# Altium schematic sheet PAPAYA_PCB.SchDoc: P.A.P.A.Y.A
size A3 portrait; Author: IMBULPITIYA B.N.; DrawnBy: IMBULPITIYA B.N.; DocumentNumber: -; Revision: Rev 1.0; SheetNumber: 1; SheetTotal: 1
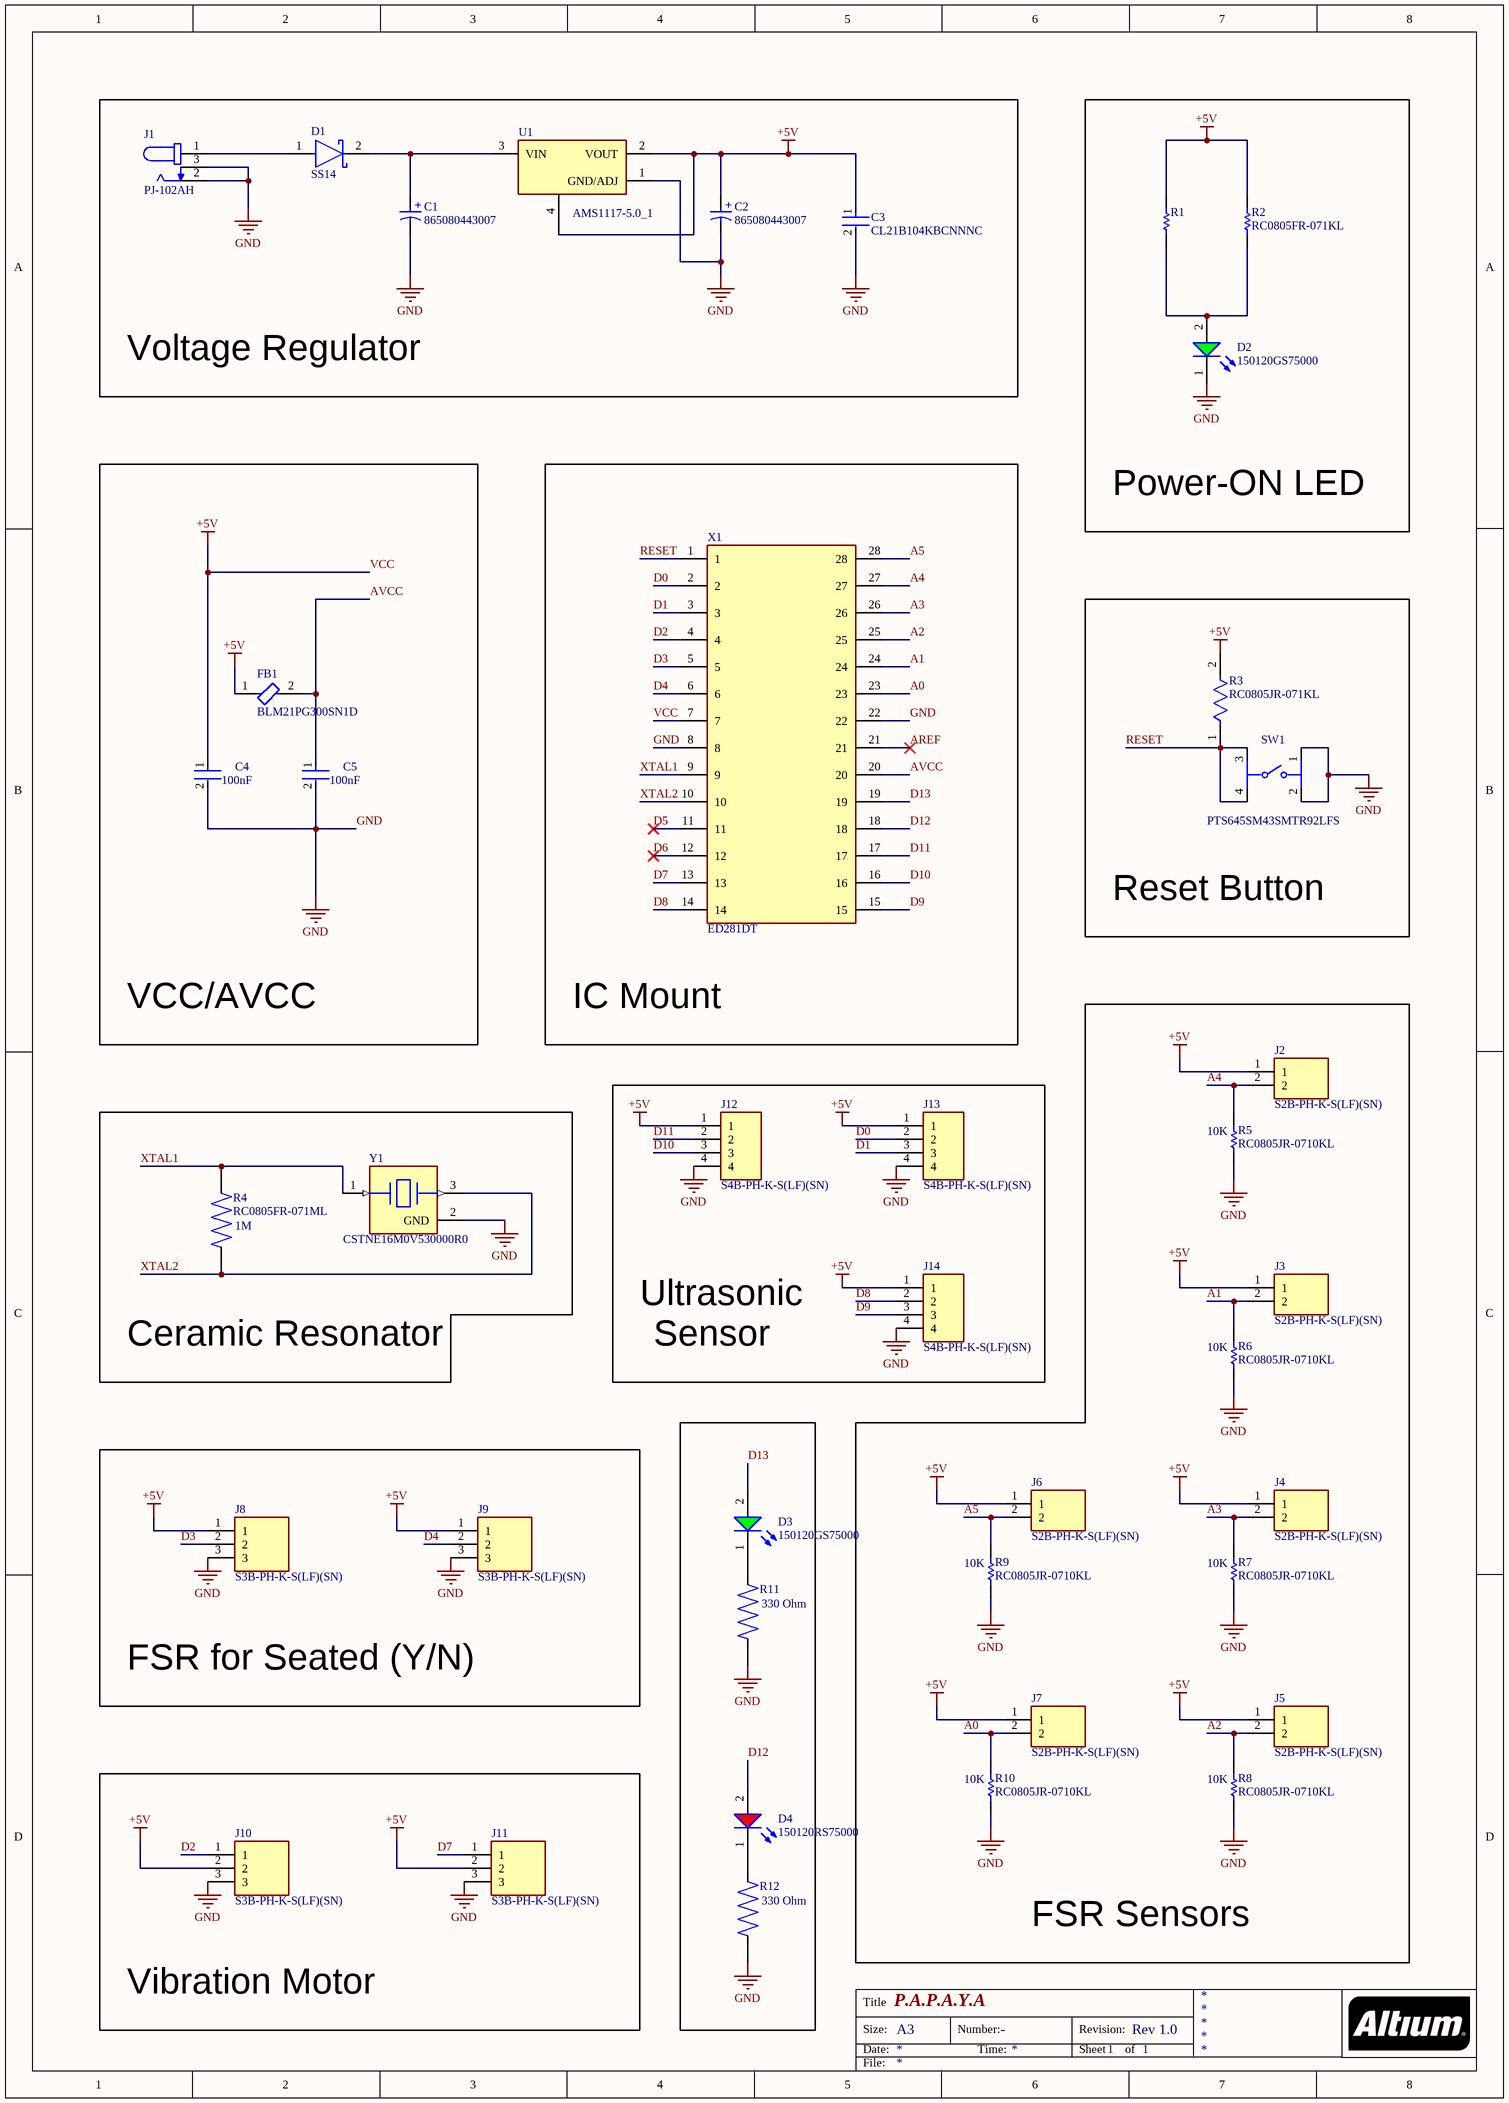
[diagram p0: PAPAYA_PCB.SchDoc]

## Parts
C1  865080443007  [WCAP-ASLI_D6.3H5.5]
C2  865080443007  [WCAP-ASLI_D6.3H5.5]
C3  CL21B104KBCNNNC  [FP-CL21-IPC_C]
C4  Capacitance: 100nF  [FP-CL21-IPC_C]  (hidden comment: CL21B104KBCNNNC)
C5  Capacitance: 100nF  [FP-CL21-IPC_C]  (hidden comment: CL21B104KBCNNNC)
D1  SS14  [FP-403AE-MFG]
D2  150120GS75000  [WL-SMCW_1206_150120xx75000]
D3  150120GS75000  [WL-SMCW_1206_150120xx75000]
D4  150120RS75000  [WL-SMCW_1206_150120xx75000]
FB1  BLM21PG300SN1D  [FP-BLM21-0_2-t0_85-e0_5-d-MFG]
J1  PJ-102AH  [CUI_PJ-102AH]
J2  S2B-PH-K-S(LF)(SN)  [JST_S2B-PH-K-S(LF)(SN)]
J3  S2B-PH-K-S(LF)(SN)  [JST_S2B-PH-K-S(LF)(SN)]
J4  S2B-PH-K-S(LF)(SN)  [JST_S2B-PH-K-S(LF)(SN)]
J5  S2B-PH-K-S(LF)(SN)  [JST_S2B-PH-K-S(LF)(SN)]
J6  S2B-PH-K-S(LF)(SN)  [JST_S2B-PH-K-S(LF)(SN)]
J7  S2B-PH-K-S(LF)(SN)  [JST_S2B-PH-K-S(LF)(SN)]
J8  S3B-PH-K-S(LF)(SN)  [JST_S3B-PH-K-S(LF)(SN)]
J9  S3B-PH-K-S(LF)(SN)  [JST_S3B-PH-K-S(LF)(SN)]
J10  S3B-PH-K-S(LF)(SN)  [JST_S3B-PH-K-S(LF)(SN)]
J11  S3B-PH-K-S(LF)(SN)  [JST_S3B-PH-K-S(LF)(SN)]
J12  S4B-PH-K-S(LF)(SN)  [JST_S4B-PH-K-S(LF)(SN)]
J13  S4B-PH-K-S(LF)(SN)  [JST_S4B-PH-K-S(LF)(SN)]
J14  S4B-PH-K-S(LF)(SN)  [JST_S4B-PH-K-S(LF)(SN)]
R1  RC0805FR-071KL  [RESC2013X60X35ML10T20]  (value not drawn)
R2  RC0805FR-071KL  [RESC2013X60X35ML10T20]
R3  RC0805JR-071KL  [FP-RC0805-0_6-MFG]
R4  RC0805FR-071ML  value 1M  [RESC2012X60N]
R5  RC0805JR-0710KL  Resistance: 10K  [RESC2013X60X35ML10T20]
R6  RC0805JR-0710KL  Resistance: 10K  [RESC2013X60X35ML10T20]
R7  RC0805JR-0710KL  Resistance: 10K  [RESC2013X60X35ML10T20]
R8  RC0805JR-0710KL  Resistance: 10K  [RESC2013X60X35ML10T20]
R9  RC0805JR-0710KL  Resistance: 10K  [RESC2013X60X35ML10T20]
R10  RC0805JR-0710KL  Resistance: 10K  [RESC2013X60X35ML10T20]
R11  value 330 Ohm  [RESC2012X60N]  (hidden comment: RC0805JR-07330RL)
R12  value 330 Ohm  [RESC2012X60N]  (hidden comment: RC0805JR-07330RL)
SW1  PTS645SM43SMTR92LFS  [SWITCH_43SMTR92LFS]
U1  AMS1117-5.0_1  [SOT229P700X180-4N]
X1  ED281DT  [OST_ED281DT]
Y1  CSTNE16M0V530000R0  [FP-CSTNE16M0V530000R0-MFG]

## Blocks framed on the sheet
Voltage Regulator: C1-C3 D1 J1 U1
Power-ON LED: D2 R1 R2
VCC/AVCC: C4 C5 FB1
IC Mount: X1
Reset Button: R3 SW1
FSR Sensors: J2-J7 R5-R10
Ceramic Resonator: R4 Y1
FSR for Seated (Y/N): J8 J9
Vibration Motor: J10 J11

## Nets
GND: C1.2(N) C2.2(N) C3.2 C4.2 C5.2 D2.1(K) J1.2 J1.3 J8.3 J9.3 J10.3 J11.3 J12.4 J13.4 J14.4 R5.1 R6.1 R7.1 R8.1 R9.1 R10.1 R11.1 R12.1 SW1.1 SW1.2 U1.1(GND/ADJ) X1.8 X1.22 Y1.2(GND)
VCC: C2.1(P) C3.1 C4.1 FB1.1 J2.1 J3.1 J4.1 J5.1 J6.1 J7.1 J8.1 J9.1 J10.2 J11.2 J12.1 J13.1 J14.1 R1.2 R2.2 R3.2 U1.2(VOUT) U1.4(TAB) X1.7  [also labelled +5V]
A0: J7.2 R10.2 X1.23
A1: J3.2 R6.2 X1.24
A2: J5.2 R8.2 X1.25
A3: J4.2 R7.2 X1.26
A4: J2.2 R5.2 X1.27
A5: J6.2 R9.2 X1.28
AREF: X1.21
AVCC: C5.1 FB1.2 X1.20
D0: J13.2 X1.2
D1: J13.3 X1.3
D2: J10.1 X1.4
D3: J8.2 X1.5
D4: J9.2 X1.6
D5: X1.11
D6: X1.12
D7: J11.1 X1.13
D8: J14.2 X1.14
D9: J14.3 X1.15
D10: J12.3 X1.16
D11: J12.2 X1.17
D12: D4.2(A) X1.18
D13: D3.2(A) X1.19
RESET: R3.1 SW1.3 SW1.4 X1.1
XTAL1: R4.2 X1.9 Y1.1(Input)
XTAL2: R4.1 X1.10 Y1.3(Output)
NetC1_1: C1.1(P) D1.2(C) U1.3(VIN)
NetD1_1: D1.1(A) J1.1
NetD2_2: D2.2(A) R1.1 R2.1
NetD3_1: D3.1(K) R11.2
NetD4_1: D4.1(K) R12.2

## Notes on the sheet
- Ultrasonic
- Sensor
- Title
- Size:
- Date:
- A3
- Number:
- Time:
- Revision:
- Sheet
- of
- File:
- (in symbol CMP-03913-53914590-1) +

## Library data of the parts
C1 C2 = CMP-03913-53914590-1: 865080443007 WCAP-ASLI Aluminum Electrolytic Capacitors; Polarity: Polar; Insulation Resistance: 2.12766MΩ; Ripple Current: 220mA; Voltage Rating: 25V; Leakage Current: 11.75µA; Capacitance: 47µF; ESR (Equivalent Series Resistance): 397.678mΩ; Life (Hours): 2000hours; Tolerance: 20%; Impedance: 560mΩ; Max Operating Temperature: 105°C; Packaging: Cut Tape (CT); Height: 5.5mm; Width: 6.6mm; Min Operating Temperature: -55°C; Length: 5.5mm; Mount: Surface Mount; Height - Seated (Max): 5.5118mm; Voltage Rating (DC): 25V; Diameter: 6.3mm; REACH SVHC: Unknown; NexarPartId: 53914590; RoHS: Compliant; Case/Package: Radial; Ripple Current (AC): 220mA
C3-C5 = CMP-2000-05017-2: CL21 Series 0805 100nF 50V ±10% Tolerance X7R Multilayer Ceramic Chip Capacitor; Depth: 1.25mm; Height: 0.85mm; Width: 0.049inch; Tolerance: 10%; Case Code (Metric): 2012; Case Code (Imperial): 0805; Material: Ceramic; Thickness: 0.037inch; Min Operating Temperature: -55°C; Contact Plating: Tin; Length: 2mm; Mount: Surface Mount; Voltage Rating (DC): 50V; Lead Free: Lead Free; Dielectric: X7R; Radiation Hardening: No; Voltage Rating: 50V; Case/Package: 0805; Packaging: Tape and Reel; Max Operating Temperature: 125°C; Voltage: 50V
  C3: Capacitance: 100nF
D1 = CMP-2000-04943-2: DIODE SCHOTTKY 40V 1A SMA; Manufacturer: ON Semiconductor; Peak Reverse Current: 0.2mA; Max Junction Temp: +125°C; Standoff Height: 0.05mm; Max Surge Forward Current: 40A; Mouser Description: Schottky Diodes & Rectifiers SMA 40V 1.0A; RoHS: TRUE; Lead Free: Yes; Manufacturer Part Number: SS14; Device Class L3: Schottky Diodes; Category: Diode; Automotive: No; Digikey Description: DIODE SCHOTTKY 40V 1A SMA; ComponentLink2Description: Datasheet; Device Class L2: Diodes; Height: 2.5mm; Temperature Range High: +125°C; ComponentLink2URL: https://www.onsemi.com/pub/Collateral/SS19-D.PDF; Device Class L1: Discrete Semiconductors; Package: 403AE; Octopart: https://octopart.com/ss14-on+semiconductor-29205033; Max Repetitive Reverse Voltage: 40V; Temperature Range Low: -65°C; Forward Current: 1A; Temperature: -65°C to +125°C
D2 D3 = CMP-1426-00007-3: WURTH ELEKTRONIK - 150080GS75000 - LED, Green, SMD, 0805, 30 mA, 3.2 V, 520 nm; Forward Voltage: 3.2V; Viewing Angle: 140°; Power Dissipation: 105mW; Peak Wavelength: 515nm; Max Reverse Voltage (DC): 5V; Luminous Intensity: 450mcd; Wavelength: 525nm; Max Junction Temperature (Tj): 95°C; Forward Current: 100mA; Test Current: 20mA; Lens Style: Clear, Rectangular; Length: 2mm; Case/Package: 0805; Case Code (Metric): 2012; Color: Green; Height: 700µm; Width: 1.25mm; Packaging: Tape and Reel; Mount: Surface Mount; REACH SVHC: Unknown; RoHS: Compliant; Min Operating Temperature: -40°C; Reverse Voltage: 5V; Max Operating Temperature: 85°C; Dominant Wavelength: 525nm; Case Code (Imperial): 0805
D4 = CMP-1426-00011-3: LED Uni-Color Red 630nm 2-Pin Chip 0805(2012Metric) T/R; Viewing Angle: 140°; Max Junction Temperature (Tj): 95°C; Power Dissipation: 72mW; Forward Current: 100mA; Forward Voltage: 2V; Wavelength: 625nm; Test Current: 20mA; Max Reverse Voltage (DC): 5V; Luminous Intensity: 150mcd; Lens Style: Clear, Rectangular; REACH SVHC: Unknown; Height: 700µm; Case Code (Metric): 2012; Peak Wavelength: 630nm; Length: 2mm; Width: 1.25mm; RoHS: Compliant; Packaging: Tape and Reel; Dominant Wavelength: 625nm; Color: Red; Case Code (Imperial): 0805; Min Operating Temperature: -40°C; Mount: Surface Mount; Max Operating Temperature: 85°C; Case/Package: 0805
FB1 = CMP-0686-00620-3: Chip Ferrite Bead, 0805, 30Ω @ 100MHz, 0.014Ω, , 4A; Tolerance: 25%; Number of Circuits: 1; Impedance: 30R; Max DC Current: 3A; Shielding: Unshielded; Material: Steel; Resistance: 15mR; DC Resistance-Max: 14mR; Series: BLM21P; Military Standard: Not; Max Current Rating: 4A; Termination: SMD/SMT; Length: 2mm; Width: 1.25mm; Test Frequency: 100MHz; Packaging: Tape and Reel; Case/Package: 0805; Current Rating: 4A; Depth: 1.25mm; Package Quantity: 1; REACH SVHC: No SVHC; Core Material: Ferrite; Max Operating Temperature: 125°C; DC Current: 3A; Height: 0.85mm; Frequency: 100MHz; Number of Lines: 1; Case Code (Metric): 2012; Min Operating Temperature: -55°C; Radiation Hardening: No; Case Code (Imperial): 0805; Number of Pins: 2; RoHS Compliant: Yes; DC Resistance (DCR): 14mR; Lead Free: Lead Free
J1 = PJ-102AH: 2.0 x 6.5 mm, 5.0 A, Horizontal, Through Hole, Tapered Pins, Dc Power Jack Connector; MF: Same Sky; SnapEDA_Link: https://www.snapeda.com/parts/PJ-102AH/Same+Sky/view-part/?ref=snap; Package: None; Value: *; MP: PJ-102AH; Check_prices: https://www.snapeda.com/parts/PJ-102AH/Same+Sky/view-part/?ref=eda; Supplier: Digikey; Supplier Part Number: CP-102AH-ND; Manufacturer: Same Sky; Manufacturer Part Number: PJ-102AH; RoHS: No; Stock: 37690; Pricing: 1=0.76, 10=0.646, 25=0.6056, 50=0.5766, 200=0.5227, 400=0.4977, 600=0.48367, 1000=0.46653, 2600=0.43611 (USD); ComponentLink1URL: https://datasheet.octopart.com/PJ-102AH-Same-Sky-datasheet-182049965.pdf?src-supplier=Future+Electronics; ComponentLink1Description: https://datasheet.octopart.com/PJ-102AH-Same-Sky-datasheet-182049965.pdf?src-supplier=Future+Electronics; ComponentLink2URL: http://www.cui.com/Product/Resource/FuturePDF/PJ-102AH.pdf?src-supplier=Future+Electronics; ComponentLink2Description: http://www.cui.com/Product/Resource/FuturePDF/PJ-102AH.pdf?src-supplier=Future+Electronics; ComponentLink3URL: https://datasheet.octopart.com/PJ-102AH-Same-Sky-datasheet-182881008.pdf?src-supplier=Electro+Sonic; ComponentLink3Description: https://datasheet.octopart.com/PJ-102AH-Same-Sky-datasheet-182881008.pdf?src-supplier=Electro+Sonic; ComponentLink4URL: https://datasheet.octopart.com/PJ-102AH-CUI-Devices-datasheet-175925642.pdf?src-supplier=Master+Electronics; ComponentLink4Description: https://datasheet.octopart.com/PJ-102AH-CUI-Devices-datasheet-175925642.pdf?src-supplier=Master+Electronics
J2-J7 = S2B-PH-K-S(LF)(SN): Connector Header Through Hole, Right Angle 2 position; MF: JST Sales America Inc.; Price: None; Availability: In Stock; Package: None; MP: S2B-PH-K-S(LF)(SN); Value: *; SnapEDA_Link: https://www.snapeda.com/parts/S2B-PH-K-S(LF)(SN)/JST+Sales+America+Inc./view-part/?ref=snap; Purchase-URL: https://pricing.snapeda.com/search/part/S2B-PH-K-S(LF)(SN)/?ref=eda; Check_prices: https://www.snapeda.com/parts/S2B-PH-K-S(LF)(SN)/JST+Sales+America+Inc./view-part/?ref=eda
J8-J11 = S3B-PH-K-S(LF)(SN): Connector Header Through Hole, Right Angle 3 position 0.079" (2.00mm); Price: None; MP: S3B-PH-K-S(LF)(SN); Availability: Unavailable; Value: *; Package: None
J12-J14 = S4B-PH-K-S(LF)(SN): Connector Header Through Hole, Right Angle 4 position 0.079 _2.00mm_; MP: S4B-PH-K-S_LF__SN_; MF: JST Sales; Price: None; Package: None; Value: *; Availability: Unavailable; SnapEDA_Link: https://www.snapeda.com/parts/S4B-PH-K-S%28LF%29%28SN%29/JST%20Sales%20America%20Inc./view-part/591324/?ref=snap
R1 R2 = CMP-2100-03671-1: Chip Resistor, 1 KOhm, +/- 1%, 125 mW, -55 to 155 degC, 0805 (2012 Metric), RoHS, Tape and Reel; Manufacturer: Yageo; Temperature Coefficient: 100ppm/degreesC; Voltage Rating (DC): 150V; Max Power Dissipation: 125mW; Resistance: 1KOhm; Number of Pins: 2; Number of Terminations: 2; Datasheet URL: http://www.yageo.com/NewPortal/yageodocoutput?fileName=/pdf/R-Chip/PYu-RC_Group_51_RoHS_L_5.pdf; Length: 0.079inch; Package Description: 2-Pin Surface Mounted Device, Body 2 x 1.25 mm; Depth: 1.25mm; Height: 0.024inch; Military Standard: Not; Case/Package: 0805; Package Reference: 0805; RoHSCompliant: true; Lead Free: LeadFree; Packaging: TapeandReel; Package Quantity: 1; Datasheet Version: Rev. 5, 10/2016; Tolerance: 1%; Min Operating Temperature: -55degC; Voltage Rating: 150V; Composition: ThickFilm; Case Code (Imperial): 0805; Power Rating: 125mW; Width: 0.049inch; Case Code (Metric): 2012; Manufacturer URL: http://www.yageo.com/; Max Operating Temperature: 155degC; REACH SVHC: Unknown; Termination: SMD/SMT
R3 = CMP-03412-037820-1: RES SMD 1K OHM 5% 1/8W 0805; Voltage Rating: 150V; Resistance: 1kR; Max Power Dissipation: 125mW; Temperature Coefficient: 100ppm/°C; Size Code: 0805; Series: RC; Number of Terminations: 2; Tolerance: 5%; Features: Moisture Resistant; Termination: SMD/SMT; Min Operating Temperature: -55°C; Construction: Rectangular; Lead Free: Lead Free; Contact Plating: Tin; Radiation Hardening: No; Packaging: Tape and Reel; Length: 2mm; Resistor Type: Thick Film; Military Standard: Not; Case Code (Metric): 2012; Depth: 1.25mm; Case Code (Imperial): 0805; Power Rating: 125mW; Max Operating Temperature: 155°C; Resistance Tolerance: 5%; RoHS Compliant: Yes; Case/Package: 0805
R4 = RC0805FR-071ML: 1 MOhms Â±1% 0.125W, 1/8W Chip Resistor 0805 (2012 Metric) Moisture Resistant Thick Film; MF: Yageo; SnapEDA_Link: https://www.snapeda.com/parts/RC0805FR-071ML/Yageo/view-part/?ref=snap; Package: 2012 Yageo; MP: RC0805FR-071ML; Check_prices: https://www.snapeda.com/parts/RC0805FR-071ML/Yageo/view-part/?ref=eda
R5-R10 = CMP-2000-05025-1: Chip Resistor, 10 KOhm, +/- 5%, 0.125 W, -55 to 155 degC, 0805 (2012 Metric), RoHS, Tape and Reel; Manufacturer: Yageo; Resistor Element Type: ThickFilm; Voltage Rating: 150V; Product Range: RCSeries; SVHC: ToBeAdvised; Resistor Case Style: 0805[2012Metric]; Temperature Coefficient: ±100ppm/degC; Power Rating: 250mW; Automotive Qualification Standard: -; Datasheet Version: REV. 2, 09/2004; Packaging: CutTape; Resistance Tolerance: ±5%; MSL: MSL1-Unlimited; Manufacturer URL: http://www.yageo.com/; Datasheet URL: http://www.yageo.ru/pdf/RC0805.pdf; Package Description: 2-Pin Surface Mounted Device, Body 2 x 1.25 mm; Package Reference: 805
R11 R12 = RC0805JR-07330RL: Fixed Resistor, Metal Glaze/thick Film, 0.125W, 330ohm, 150V, 5% +/-Tol, 100ppm/Cel, Surface Mount, 0805; MF: Yageo; Additional Feature: LASER TRIMMABLE; Power: 125mW; Rated Temperature: 70°C; Temperature Coefficient (ppm/Cel): 100; Package Height: 0.5mm; Package Length: 2mm; Package Width: 1.25mm; Purchase-URL: https://pricing.snapeda.com/search/part/RC0805JR-07330RL/?ref=eda; MP: RC0805JR-07330RL; SnapEDA_Link: https://www.snapeda.com/parts/RC0805JR-07330RL/Yageo/view-part/615249/?ref=snap; Package: 2012 Rohm Semiconductor; Digi-Key_Part_Number: 311-330ARCT-ND; Check_prices: https://www.snapeda.com/parts/RC0805JR-07330RL/Yageo/view-part/615249/?ref=eda; Supplier: Future Electronics; Supplier Part Number: 7136500; Manufacturer: Yageo; Manufacturer Part Number: RC0805JR-07330RL; RoHS: Yes; Category: Chip SMD Resistors; Stock: 65000; Pricing: 5000=0.0014, 25000=0.0014, 100000=0.0013, 250000=0.0013, 625000=0.0012 (USD); Mounting Technology: Surface Mount; Pins: 2; Package Shape: Rectangular; Case/Package: 0805; Terminal Finish: Nickel; Min Operating Temperature: -55°C; Max Operating Temperature: 155°C; Tolerance: 5%; Termination: Wraparound; JESD-609 Code: e3; Resistor Type: FIXED RESISTOR; Construction: Chip; Packaging: Tape and Reel; Technology: METAL GLAZE/THICK FILM; Working Voltage: 150V; Reach SVHC Compliant: Yes; RoHS Compliant: Yes; ComponentLink1URL: https://datasheet.ciiva.com:443/pdfs/VipMasterIC/IC/YAGO/YAGO-S-A0008145938/YAGO-S-A0008145938-1.pdf?src-supplier=IHS+Markit; ComponentLink1Description: https://datasheet.ciiva.com:443/pdfs/VipMasterIC/IC/YAGO/YAGO-S-A0008145938/YAGO-S-A0008145938-1.pdf?src-supplier=IHS+Markit; ComponentLink2URL: https://datasheet.ciiva.com/17008/rc0805-17008395.pdf?src-supplier=Future+Electronics; ComponentLink2Description: https://datasheet.ciiva.com/17008/rc0805-17008395.pdf?src-supplier=Future+Electronics; ComponentLink3URL: https://datasheet.ciiva.com/12555/rc0805-257173-12555078.pdf?src-supplier=Mouser; ComponentLink3Description: https://datasheet.ciiva.com/12555/rc0805-257173-12555078.pdf?src-supplier=Mouser; ComponentLink4URL: https://datasheet.ciiva.com/46395/444164-46395119.pdf?src-supplier=Element14; ComponentLink4Description: https://datasheet.ciiva.com/46395/444164-46395119.pdf?src-supplier=Element14; ComponentLink5URL: https://datasheet.ciiva.com/7941/442941-7941941.pdf?src-supplier=Element14; ComponentLink5Description: https://datasheet.ciiva.com/7941/442941-7941941.pdf?src-supplier=Element14; ComponentLink6URL: https://datasheet.ciiva.com/7941/442941-7941942.pdf?src-supplier=Element14; ComponentLink6Description: https://datasheet.ciiva.com/7941/442941-7941942.pdf?src-supplier=Element14
SW1 = PTS645SM43SMTR92LFS_1: SWITCH TACTILE SPST-NO 0.05A 12V; Contact Resistance: 100mR; Throw Configuration: SPST; Illumination Type: Non-Illuminated; Mechanical Life: 100000Cycles; Current Rating: 50mA; Switch Function: Off-Mom; Actuator Length: 0.85mm; Actuator Material: Nylon; Actuator Type: Standard; Operating Force: 160gf; Min Operating Temperature: -20°C; REACH SVHC: No SVHC; Termination: Gull Wing; Case/Package: SMD/SMT; Packaging: Tape and Reel; Mount: Surface Mount; Voltage Rating (DC): 12V; Orientation: Straight; Lead Free: Lead Free; Contact Material: Silver; Color: Black; Max Current Rating: 50mA; Contact Plating: Silver; Depth: 9mm; Package Quantity: 1; Max Voltage Rating (DC): 12V; Length: 6mm; Max Operating Temperature: 60°C
U1 = AMS1117-5.0_1: 1A LOW DROPOUT VOLTAGE REGULATOR; MF: ams; MP: AMS1117-5.0; Package: SOT-223 Seeed Technology; SnapEDA_Link: https://www.snapeda.com/parts/AMS1117-5.0/ams/view-part/?ref=snap; Check_prices: https://www.snapeda.com/parts/AMS1117-5.0/ams/view-part/?ref=eda; Availability: Not in stock; Value: *; Price: None
X1 = ED281DT: CONN IC DIP SOCKET 28POS TIN; MP: altium_native_batch; Package: None; Value: *; Availability: Unavailable; Price: None
Y1 = CMP-06054-000001-1: CERAMIC RES 16.0000MHZ 15PF SMD; Manufacturer: Murata; Tolerance: 0.5%; Stability: 0.3%; Frequency: 16MHz; Esr: 40Ω; Lead Free: Yes; ComponentLink2URL: https://www.murata.com/en-sg/products/productdata/8801162231838/SPEC-CSTNE16M0V530000R0.pdf?1545967809000; ComponentLink2Description: Datasheet; Device Class L3: Crystals; Load Capacitance: 15pF; Temperature: -40°C to +85°C; Temperature Range High: +85°C; Series: CSTNE_V; Mouser Description: Ceramic Resonator 16MHz ±0.5% (Tol) ±0.3% (Stability) 15pF 40Ohm 3-Pin CSMD T/R; Automotive: No; RoHS: TRUE; Device Class L2: Crystals / Oscillators; Manufacturer Part Number: CSTNE16M0V530000R0; Package: 0; Category: Crys; Device Class L1: Passive Components; Height: 1mm; Temperature Range Low: -40°C; Digikey Description: CERAMIC RES 16.0000MHZ 15PF SMD; Octopart: https://octopart.com/cstne16m0v530000r0-murata-91406924